# EAGLE board slot1 (EAGLE 6.6.0), part 1 of 2
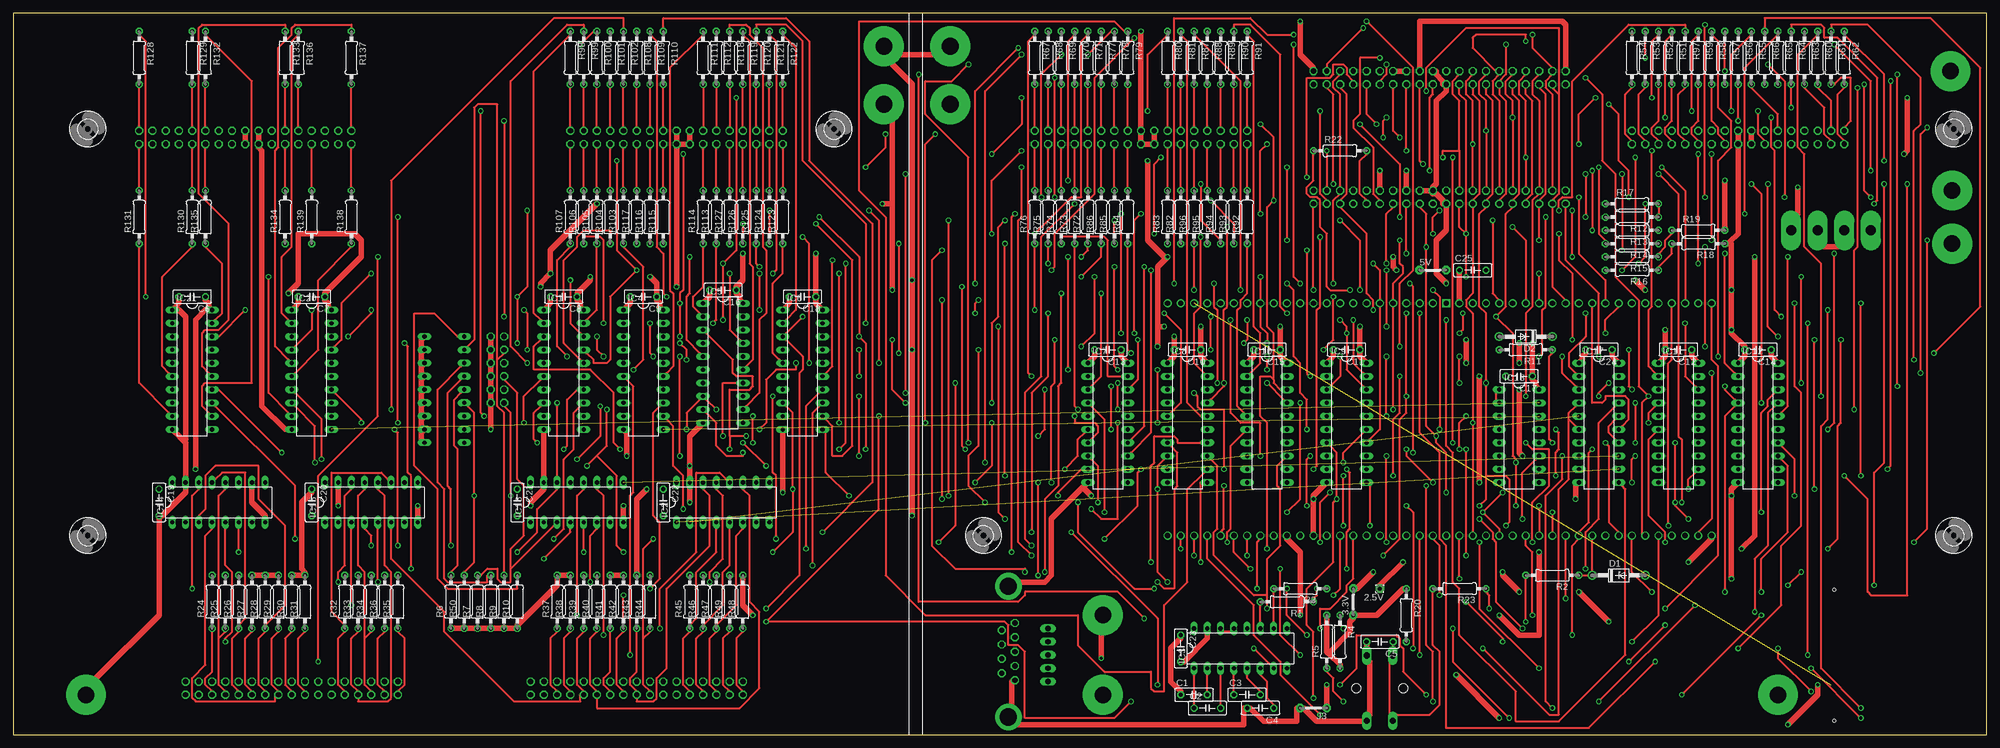
[diagram p3: board, top side]
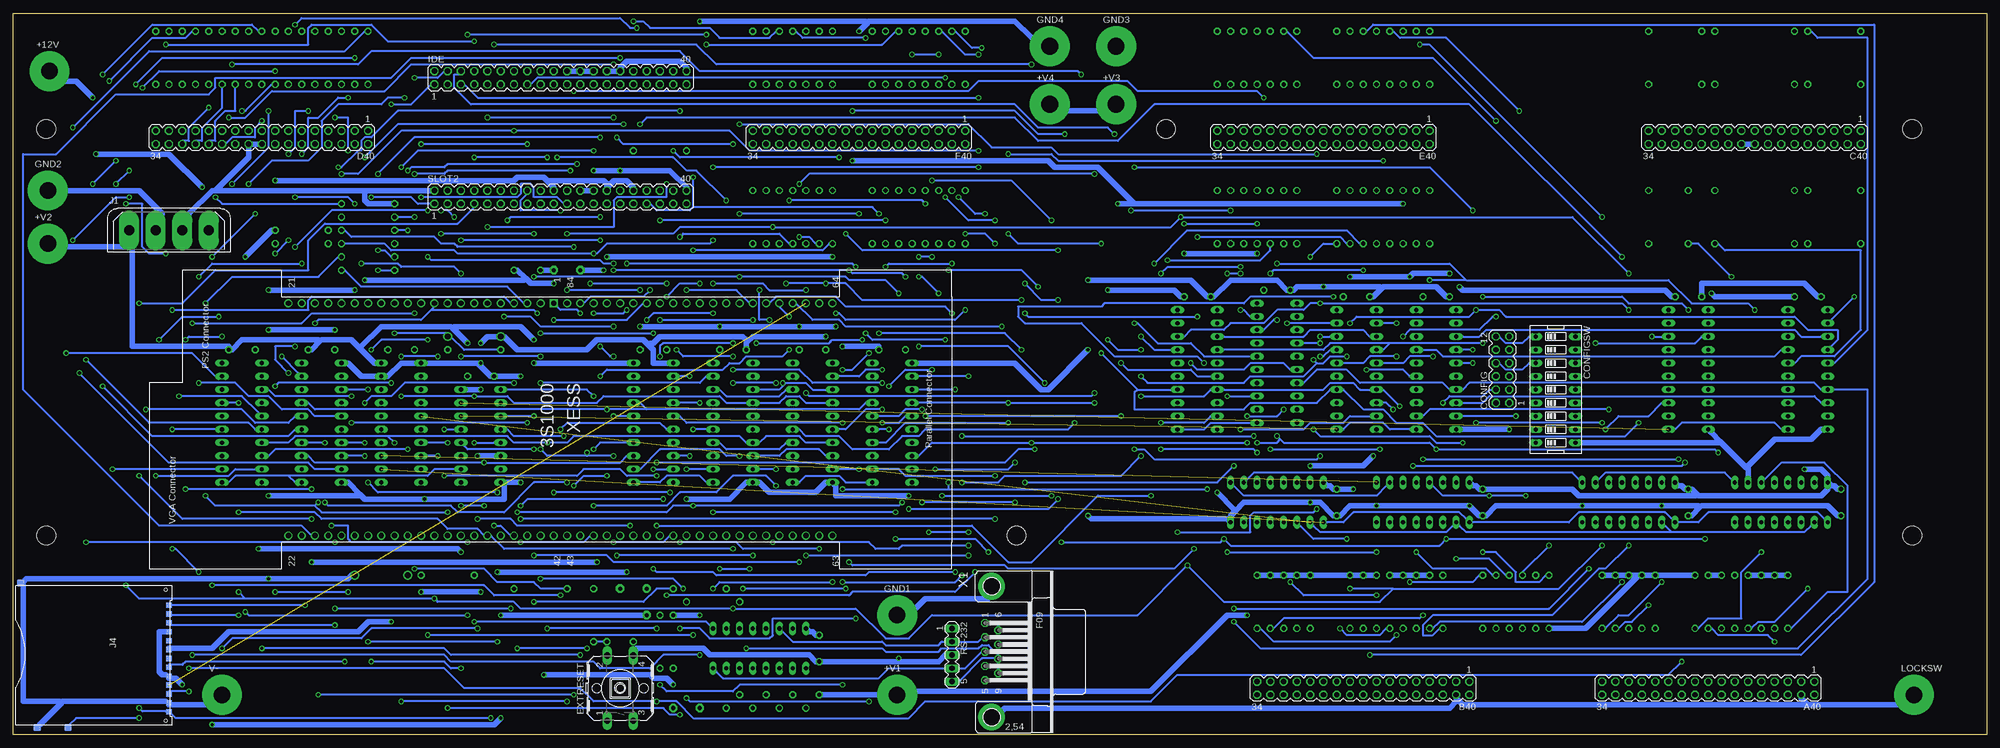
[diagram p4: board, bottom side, seen from below]

Size 377.82 x 138.11 mm. Coordinates in mm from the lower left corner, seen from the top.
Outline: 377.82,138.11 377.82,0 174.62,0 171.45,0 0,0 0,138.11 171.45,138.11 173.04,138.11
Outline: 377.82,138.11 173.99,138.11
Outline: 173.99,138.11 173.04,138.11
Outline: 377.82,138.11 173.99,138.11
Outline: 173.99,138.11 173.04,138.11
Copper layers (1*16): Top 0.035mm / dielectric 1.5mm / Bottom 0.035mm
Design rules "15mils": minimum track width 15mil, minimum drill 24mil, track to track 15mil, track to pad 10mil, pad to pad 10mil, via to via 10mil, smd to smd 10mil, copper to edge 25mil, drill to drill 10mil, minimum pad ring 10mil, minimum via ring 8mil, stop-mask expansion 0mil, vias tented up to drill 0mil, thermal gap 10mil
Net classes: 1 supply: width 1.016 mm

## Footprints (pad centres in the part's own frame; a part is rotated, then mirrored left to right if it is on the bottom)
1,6/0,8 = drill 0.813 pad 1.6 octagon: 1 0,0
05 = drill 0.813 pad 1.6 octagon: 1 -2.54,0; 2 2.54,0
SPADELUG = drill 3.175 pad 7.62: 1 0,0
MA17-2 = drill 1.016 octagon: 1 -20.32,-1.27; 2 -20.32,1.27; 3 -17.78,-1.27; 4 -17.78,1.27; 5 -15.24,-1.27; 6 -15.24,1.27; 7 -12.7,-1.27; 8 -12.7,1.27; 9 -10.16,-1.27; 10 -10.16,1.27; 11 -7.62,-1.27; 12 -7.62,1.27; 13 -5.08,-1.27; 14 -5.08,1.27; 15 -2.54,-1.27; 16 -2.54,1.27; 17 0,-1.27; 18 0,1.27; 19 2.54,-1.27; 20 2.54,1.27; 21 5.08,-1.27; 22 5.08,1.27; 23 7.62,-1.27; 24 7.62,1.27; 25 10.16,-1.27; 26 10.16,1.27; 27 12.7,-1.27; 28 12.7,1.27; 29 15.24,-1.27; 30 15.24,1.27; 31 17.78,-1.27; 32 17.78,1.27; 33 20.32,-1.27; 34 20.32,1.27
C050-025X075 = drill 0.813 octagon: 1 -2.54,0; 2 2.54,0
MA06-2 = drill 1.016 octagon: 1 -6.35,-1.27; 2 -6.35,1.27; 3 -3.81,-1.27; 4 -3.81,1.27; 5 -1.27,-1.27; 6 -1.27,1.27; 7 1.27,-1.27; 8 1.27,1.27; 9 3.81,-1.27; 10 3.81,1.27; 11 6.35,-1.27; 12 6.35,1.27
EDG-09 = drill 0.813 long: 1 -10.16,-3.81; 2 -7.62,-3.81; 3 -5.08,-3.81; 4 -2.54,-3.81; 5 0,-3.81; 6 2.54,-3.81; 7 5.08,-3.81; 8 7.62,-3.81; 9 10.16,-3.81; 10 10.16,3.81; 11 7.62,3.81; 12 5.08,3.81; 13 2.54,3.81; 14 0,3.81; 15 -2.54,3.81; 16 -5.08,3.81; 17 -7.62,3.81; 18 -10.16,3.81
DO41Z10 = drill 1.118: A 5.08,0; C -5.08,0
B3F-40XX = drill 1.194 long: 1 -6.248,2.489; 2 6.248,2.489; 3 -6.248,-2.489; 4 6.248,-2.489 | hole 1.803: 0,-4.496; 0,4.496
DIL20 = drill 0.813 long: 1 -11.43,-3.81; 2 -8.89,-3.81; 3 -6.35,-3.81; 4 -3.81,-3.81; 5 -1.27,-3.81; 6 1.27,-3.81; 7 3.81,-3.81; 8 6.35,-3.81; 9 8.89,-3.81; 10 11.43,-3.81; 11 11.43,3.81; 12 8.89,3.81; 13 6.35,3.81; 14 3.81,3.81; 15 1.27,3.81; 16 -1.27,3.81; 17 -3.81,3.81; 18 -6.35,3.81; 19 -8.89,3.81; 20 -11.43,3.81
DIL16 = drill 0.813 long: 1 -8.89,-3.81; 2 -6.35,-3.81; 3 -3.81,-3.81; 4 -1.27,-3.81; 5 1.27,-3.81; 6 3.81,-3.81; 7 6.35,-3.81; 8 8.89,-3.81; 9 8.89,3.81; 10 6.35,3.81; 11 3.81,3.81; 12 1.27,3.81; 13 -1.27,3.81; 14 -3.81,3.81; 15 -6.35,3.81; 16 -8.89,3.81
MA20-2 = drill 1.016 octagon: 1 -24.13,-1.27; 2 -24.13,1.27; 3 -21.59,-1.27; 4 -21.59,1.27; 5 -19.05,-1.27; 6 -19.05,1.27; 7 -16.51,-1.27; 8 -16.51,1.27; 9 -13.97,-1.27; 10 -13.97,1.27; 11 -11.43,-1.27; 12 -11.43,1.27; 13 -8.89,-1.27; 14 -8.89,1.27; 15 -6.35,-1.27; 16 -6.35,1.27; 17 -3.81,-1.27; 18 -3.81,1.27; 19 -1.27,-1.27; 20 -1.27,1.27; 21 1.27,-1.27; 22 1.27,1.27; 23 3.81,-1.27; 24 3.81,1.27; 25 6.35,-1.27; 26 6.35,1.27; 27 8.89,-1.27; 28 8.89,1.27; 29 11.43,-1.27; 30 11.43,1.27; 31 13.97,-1.27; 32 13.97,1.27; 33 16.51,-1.27; 34 16.51,1.27; 35 19.05,-1.27; 36 19.05,1.27; 37 21.59,-1.27; 38 21.59,1.27; 39 24.13,-1.27; 40 24.13,1.27
FLOPPY-4 = drill 1.93 pad 3.81 long: 1 7.62,0; 2 2.54,0; 3 -2.54,0; 4 -7.62,0
SCDA5A = smd 1 x 1.3: 1 -7.525,-0.65; 2 -5.825,-0.65; 3 -4.125,-0.65; 3A -2.425,-0.65; 4 -0.725,-0.65; 4A 0.975,-0.65; 5 2.675,-0.65; 6 4.375,-0.65; 7 6.075,-0.65; 8 7.775,-0.65; 9 -9.225,-0.65; 10 11.175,-0.65; 11 9.475,-0.65 | smd 1.4 x 1.4: 12 14.2,-19.955; 13 14.2,-25.875; 14 -13.475,-28.975 | hole 0.61: 12.875,-1.235; -12.125,-1.235
0207/10 = drill 0.813 octagon: 1 -5.08,0; 2 5.08,0
MA05-1 = drill 1.016 long: 1 -5.08,0; 2 -2.54,0; 3 0,0; 4 2.54,0; 5 5.08,0
3,6 = hole 3.6: 0,0
F09HP = drill 1.016 octagon: 1 -5.486,-1.27; 2 -2.743,-1.27; 3 0,-1.27; 4 2.743,-1.27; 5 5.486,-1.27; 6 -4.115,1.27; 7 -1.372,1.27; 8 1.372,1.27; 9 4.115,1.27 | drill 3.302 pad 5.08: G1 -12.522,0; G2 12.522,0
3S1000 = drill 1.016 square: 1 0,0 | drill 1.016: 2 0,-2.54; 3 0,-5.08; 4 0,-7.62; 5 0,-10.16; 6 0,-12.7; 7 0,-15.24; 8 0,-17.78; 9 0,-20.32; 10 0,-22.86; 11 0,-25.4; 12 0,-27.94; 13 0,-30.48; 14 0,-33.02; 15 0,-35.56; 16 0,-38.1; 17 0,-40.64; 18 0,-43.18; 19 0,-45.72; 20 0,-48.26; 21 0,-50.8; 22 44.45,-50.8; 23 44.45,-48.26; 24 44.45,-45.72; 25 44.45,-43.18; 26 44.45,-40.64; 27 44.45,-38.1; 28 44.45,-35.56; 29 44.45,-33.02; 30 44.45,-30.48; 31 44.45,-27.94; 32 44.45,-25.4; 33 44.45,-22.86; 34 44.45,-20.32; 35 44.45,-17.78; 36 44.45,-15.24; 37 44.45,-12.7; 38 44.45,-10.16; 39 44.45,-7.62; 40 44.45,-5.08; 41 44.45,-2.54; 42 44.45,0; 43 44.45,2.54; 44 44.45,5.08; 45 44.45,7.62; 46 44.45,10.16; 47 44.45,12.7; 48 44.45,15.24; 49 44.45,17.78; 50 44.45,20.32; 51 44.45,22.86; 52 44.45,25.4; 53 44.45,27.94; 54 44.45,30.48; 55 44.45,33.02; 56 44.45,35.56; 57 44.45,38.1; 58 44.45,40.64; 59 44.45,43.18; 60 44.45,45.72; 61 44.45,48.26; 62 44.45,50.8; 63 44.45,53.34; 64 0,53.34; 65 0,50.8; 66 0,48.26; 67 0,45.72; 68 0,43.18; 69 0,40.64; 70 0,38.1; 71 0,35.56; 72 0,33.02; 73 0,30.48; 74 0,27.94; 75 0,25.4; 76 0,22.86; 77 0,20.32; 78 0,17.78; 79 0,15.24; 80 0,12.7; 81 0,10.16; 82 0,7.62; 83 0,5.08; 84 0,2.54

## Placement (x,y rotation side)
2.5V  [1,6/0,8]  261.62,27.94 180 top
3.3V  J5MM  [05]  256.54,25.4 90 top
5V  J5MM  [05]  271.78,88.9 0 top
+12V  LUG  [SPADELUG]  370.84,127 0 bottom
+V1  LUG  [SPADELUG]  208.6,7.62 0 bottom
+V2  LUG  [SPADELUG]  371.16,93.98 0 bottom
+V3  LUG  [SPADELUG]  166.69,120.65 0 bottom
+V4  LUG  [SPADELUG]  179.39,120.65 0 bottom
A40  [MA17-2]  53.34,8.89 180 bottom
B40  [MA17-2]  119.38,8.89 180 bottom
C1  0.1uf  [C050-025X075]  226.06,7.62 0 top
C2  0.1uf  [C050-025X075]  228.6,5.08 0 top
C3  0.1uf  [C050-025X075]  236.22,7.62 0 top
C4  0.1uf  [C050-025X075]  238.76,5.08 180 top
C5  0.1uf  [C050-025X075]  261.62,17.78 180 top
C6  0.1uf  [C050-025X075]  34.29,83.82 180 top
C7  0.1uf  [C050-025X075]  57.15,83.82 180 top
C8  0.1uf  [C050-025X075]  105.41,83.82 180 top
C9  0.1uf  [C050-025X075]  120.65,83.82 180 top
C10  0.1uf  [C050-025X075]  224.79,73.66 180 top
C11  0.1uf  [C050-025X075]  255.27,73.66 180 top
C12  0.1uf  [C050-025X075]  318.77,73.66 180 top
C13  0.1uf  [C050-025X075]  209.55,73.66 180 top
C14  0.1uf  [C050-025X075]  334.01,73.66 180 top
C15  0.1uf  [C050-025X075]  240.03,73.66 180 top
C16  0.1uf  [C050-025X075]  135.89,85.09 180 top
C17  0.1uf  [C050-025X075]  288.29,68.58 180 top
C18  0.1uf  [C050-025X075]  151.13,83.82 180 top
C19  0.1uf  [C050-025X075]  27.94,44.45 270 top
C20  0.1uf  [C050-025X075]  57.15,44.45 270 top
C21  0.1uf  [C050-025X075]  96.52,44.45 270 top
C22  0.1uf  [C050-025X075]  124.46,44.45 270 top
C23  0.1uf  [C050-025X075]  223.52,16.51 270 top
C24  0.1uf  [C050-025X075]  303.53,73.66 180 top
C25  0.1uf  [C050-025X075]  279.4,88.9 0 top
C40  [MA17-2]  44.45,114.3 180 bottom
CONFIG  [MA06-2]  92.71,69.85 90 bottom
CONFIGSW  [EDG-09]  82.55,66.04 270 bottom
D1  1N4728  [DO41Z10]  307.34,30.48 0 top
D2  1N4728  [DO41Z10]  289.56,76.2 180 top
D40  [MA17-2]  330.2,114.3 180 bottom
E40  [MA17-2]  127,114.3 180 bottom
EXTRESET  [B3F-40XX]  261.62,8.89 90 bottom
F40  [MA17-2]  215.9,114.3 180 bottom
GND1  LUG  [SPADELUG]  208.6,22.86 0 bottom
GND2  LUG  [SPADELUG]  371.16,104.14 0 bottom
GND3  LUG  [SPADELUG]  166.69,131.76 0 bottom
GND4  LUG  [SPADELUG]  179.39,131.76 0 bottom
IC1  74LS374N  [DIL20]  105.41,69.85 270 top
IC2  74HC165N  [DIL16]  135.89,44.45 0 top
IC3  MAX232A  [DIL16]  234.95,16.51 0 top
IC4  74LS374N  [DIL20]  120.65,69.85 270 top
IC5  74LS374N  [DIL20]  135.89,71.12 270 top
IC6  74LS374N  [DIL20]  151.13,69.85 270 top
IC7  74LS374N  [DIL20]  209.55,59.69 270 top
IC8  74LS374N  [DIL20]  224.79,59.69 270 top
IC9  74LS374N  [DIL20]  255.27,59.69 270 top
IC10  74LS374N  [DIL20]  240.03,59.69 270 top
IC11  74LS374N  [DIL20]  318.77,59.69 270 top
IC12  74LS374N  [DIL20]  334.01,59.69 270 top
IC13  74LS138N  [DIL16]  288.29,57.15 270 top
IC14  74HC165N  [DIL16]  39.37,44.45 0 top
IC15  74HC165N  [DIL16]  68.58,44.45 0 top
IC17  74LS244N  [DIL20]  303.53,59.69 270 top
IC18  74HC165N  [DIL16]  107.95,44.45 0 top
IC20  74LS374N  [DIL20]  57.15,69.85 270 top
IC21  74LS374N  [DIL20]  34.29,69.85 270 top
IDE  [MA20-2]  273.05,125.73 0 bottom
J1  [FLOPPY-4]  347.98,96.52 0 bottom
J3  J5MM  [05]  248.92,5.08 180 top
J4  SDCARD  [SCDA5A]  347.35,15.56 270 bottom
LOCKSW  LUG  [SPADELUG]  13.97,7.62 0 bottom
R1  330  [0207/10]  243.84,25.4 180 top
R2  330  [0207/10]  294.64,30.48 180 top
R3  330  [0207/10]  246.38,27.94 180 top
R4  330  [0207/10]  254,17.78 270 top
R5  330  [0207/10]  251.46,17.78 90 top
R6  3K  [0207/10]  83.82,25.4 90 top
R7  3K  [0207/10]  88.9,25.4 90 top
R8  3K  [0207/10]  91.44,25.4 90 top
R9  3K  [0207/10]  93.98,25.4 90 top
R10  3K  [0207/10]  96.52,25.4 90 top
R11  330  [0207/10]  289.56,73.66 180 top
R12  330  [0207/10]  309.88,99.06 180 top
R13  47  [0207/10]  309.88,96.52 180 top
R14  47  [0207/10]  309.88,93.98 180 top
R15  330  [0207/10]  309.88,91.44 180 top
R16  330  [0207/10]  309.88,88.9 180 top
R17  10K  [0207/10]  309.88,101.6 0 top
R18  10K  [0207/10]  322.58,93.98 180 top
R19  10K  [0207/10]  322.58,96.52 0 top
R20  4.7K  [0207/10]  266.7,22.86 270 top
R22  330  [0207/10]  254,111.76 0 top
R23  330  [0207/10]  276.86,27.94 180 top
R24  3K  [0207/10]  38.1,25.4 90 top
R25  3K  [0207/10]  40.64,25.4 90 top
R26  3K  [0207/10]  43.18,25.4 90 top
R27  3K  [0207/10]  45.72,25.4 90 top
R28  3K  [0207/10]  48.26,25.4 90 top
R29  3K  [0207/10]  50.8,25.4 90 top
R30  3K  [0207/10]  53.34,25.4 90 top
R31  3K  [0207/10]  55.88,25.4 90 top
R32  3K  [0207/10]  63.5,25.4 90 top
R33  3K  [0207/10]  66.04,25.4 90 top
R34  3K  [0207/10]  68.58,25.4 90 top
R35  3K  [0207/10]  73.66,25.4 90 top
R36  3K  [0207/10]  71.12,25.4 90 top
R37  3K  [0207/10]  104.14,25.4 90 top
R38  3K  [0207/10]  106.68,25.4 90 top
R39  3K  [0207/10]  109.22,25.4 90 top
R40  3K  [0207/10]  111.76,25.4 90 top
R41  3K  [0207/10]  114.3,25.4 90 top
R42  3K  [0207/10]  116.84,25.4 90 top
R43  3K  [0207/10]  119.38,25.4 90 top
R44  3K  [0207/10]  121.92,25.4 90 top
R45  3K  [0207/10]  129.54,25.4 90 top
R46  3K  [0207/10]  132.08,25.4 90 top
R47  3K  [0207/10]  134.62,25.4 90 top
R48  3K  [0207/10]  139.7,25.4 90 top
R49  3K  [0207/10]  137.16,25.4 90 top
R50  3K  [0207/10]  86.36,25.4 90 top
R51  [0207/10]  317.5,129.54 270 top
R52  [0207/10]  314.96,129.54 270 top
R53  [0207/10]  312.42,129.54 270 top
R54  [0207/10]  309.88,129.54 270 top
R55  [0207/10]  332.74,129.54 270 top
R56  [0207/10]  330.2,129.54 270 top
R57  [0207/10]  327.66,129.54 270 top
R58  3K  [0207/10]  325.12,129.54 270 top
R59  [0207/10]  322.58,129.54 270 top
R60  [0207/10]  345.44,129.54 270 top
R61  [0207/10]  347.98,129.54 270 top
R62  [0207/10]  350.52,129.54 270 top
R63  [0207/10]  342.9,129.54 270 top
R64  [0207/10]  340.36,129.54 270 top
R65  [0207/10]  337.82,129.54 270 top
R66  3K  [0207/10]  335.28,129.54 270 top
R67  [0207/10]  195.58,129.54 270 top
R68  [0207/10]  198.12,129.54 270 top
R69  [0207/10]  200.66,129.54 270 top
R70  [0207/10]  203.2,129.54 270 top
R71  [0207/10]  205.74,129.54 270 top
R72  [0207/10]  205.74,99.06 90 top
R73  [0207/10]  203.2,99.06 90 top
R74  3K  [0207/10]  200.66,99.06 90 top
R75  [0207/10]  198.12,99.06 90 top
R76  [0207/10]  195.58,99.06 90 top
R77  [0207/10]  208.28,129.54 270 top
R78  [0207/10]  210.82,129.54 270 top
R79  [0207/10]  213.36,129.54 270 top
R80  [0207/10]  220.98,129.54 270 top
R81  [0207/10]  223.52,129.54 270 top
R82  3K  [0207/10]  223.52,99.06 90 top
R83  [0207/10]  220.98,99.06 90 top
R84  [0207/10]  213.36,99.06 90 top
R85  [0207/10]  210.82,99.06 90 top
R86  [0207/10]  208.28,99.06 90 top
R87  [0207/10]  226.06,129.54 270 top
R88  [0207/10]  228.6,129.54 270 top
R89  [0207/10]  231.14,129.54 270 top
R90  3K  [0207/10]  233.68,129.54 270 top
R91  [0207/10]  236.22,129.54 270 top
R92  [0207/10]  236.22,99.06 90 top
R93  [0207/10]  233.68,99.06 90 top
R94  [0207/10]  231.14,99.06 90 top
R95  [0207/10]  228.6,99.06 90 top
R96  [0207/10]  226.06,99.06 90 top
R97  3K  [0207/10]  320.04,129.54 270 top
R98  [0207/10]  106.68,129.54 270 top
R99  [0207/10]  109.22,129.54 270 top
R100  [0207/10]  111.76,129.54 270 top
R101  [0207/10]  114.3,129.54 270 top
R102  [0207/10]  116.84,129.54 270 top
R103  [0207/10]  116.84,99.06 90 top
R104  [0207/10]  114.3,99.06 90 top
R105  3K  [0207/10]  111.76,99.06 90 top
R106  [0207/10]  109.22,99.06 90 top
R107  [0207/10]  106.68,99.06 90 top
R108  [0207/10]  119.38,129.54 270 top
R109  [0207/10]  121.92,129.54 270 top
R110  [0207/10]  124.46,129.54 270 top
R111  [0207/10]  132.08,129.54 270 top
R112  [0207/10]  134.62,129.54 270 top
R113  3K  [0207/10]  134.62,99.06 90 top
R114  [0207/10]  132.08,99.06 90 top
R115  [0207/10]  124.46,99.06 90 top
R116  [0207/10]  121.92,99.06 90 top
R117  [0207/10]  119.38,99.06 90 top
R118  [0207/10]  137.16,129.54 270 top
R119  [0207/10]  139.7,129.54 270 top
R120  [0207/10]  142.24,129.54 270 top
R121  3K  [0207/10]  144.78,129.54 270 top
R122  [0207/10]  147.32,129.54 270 top
R123  [0207/10]  147.32,99.06 90 top
R124  [0207/10]  144.78,99.06 90 top
R125  [0207/10]  142.24,99.06 90 top
R126  [0207/10]  139.7,99.06 90 top
R127  3K  [0207/10]  137.16,99.06 90 top
R128  [0207/10]  24.13,129.54 270 top
R129  [0207/10]  34.29,129.54 270 top
R130  [0207/10]  34.29,99.06 90 top
R131  [0207/10]  24.13,99.06 90 top
R132  [0207/10]  36.83,129.54 270 top
R133  [0207/10]  52.07,129.54 270 top
R134  [0207/10]  52.07,99.06 90 top
R135  3K  [0207/10]  36.83,99.06 90 top
R136  [0207/10]  54.61,129.54 270 top
R137  [0207/10]  64.77,129.54 270 top
R138  [0207/10]  64.77,99.06 90 top
R139  3K  [0207/10]  57.15,99.06 90 top
RS-232  [MA05-1]  198.12,15.24 270 bottom
SLOT2  [MA20-2]  273.05,102.87 0 bottom
U$5  [3,6]  371.48,115.89 0 top
U$6  [3,6]  371.48,38.1 0 top
U$7  [3,6]  185.74,38.1 0 top
U$8  [3,6]  14.29,38.1 0 top
U$9  [3,6]  14.29,115.89 0 top
U$11  [3,6]  157.16,115.89 0 top
V-  LUG  [SPADELUG]  337.82,7.62 0 bottom
X1  [F09HP]  190.5,15.88 270 bottom
XESS  3S1000  [3S1000]  274.32,82.55 270 bottom

## Tracks (layer width: path | path; a pad name or v marks a point on that pad's centre or on a via)
3S-LCLK  (via drill 0.61)
  Top 0.381: 297.81,60.33 299.08,59.05 IC17.6 | 297.81,60.33 297.81,61.59 299.08,62.87 IC17.4 | v231.78,47.62 231.78,39.37 231.14,38.73 XESS.59 | v266.7,43.81 267.97,42.55 v267.97,16.51 | v281.31,16.51 294,3.81 295.91,3.81 295.91,46.99 297.81,48.9 297.81,60.33
  Bottom 0.381: v231.78,47.62 233.68,49.53 240.03,49.53 243.21,46.35 250.19,46.35 252.73,43.81 v266.7,43.81 | v267.97,16.51 v281.31,16.51
3S-LSER  (via drill 0.61)
  Top 0.381: v300.99,80.64 300.99,76.2 297.81,73.03 297.81,70.48 299.08,69.22 IC17.2 | v343.54,15.24 v343.54,78.74 | v246.38,15.24 242.57,19.05 v242.57,31.75 | v236.85,31.75 233.68,34.92 233.68,37.47 XESS.58
  Bottom 0.381: v300.99,80.64 320.68,80.64 322.58,78.74 v343.54,78.74 | v343.54,15.24 295.27,15.24 294,13.97 266.7,13.97 265.43,12.7 255.91,12.7 253.37,15.24 v246.38,15.24 | v242.57,31.75 v236.85,31.75
3S-SCLK
  Top 0.381: IC17.15 307.98,59.05 309.25,60.33 309.25,64.14 308.61,64.77 304.8,64.77 304.8,64.14 304.17,63.5 302.26,63.5 302.26,81.92 XESS.12
3S-SSER  (via drill 0.61)
  Top 0.381: v304.8,76.83 304.8,79.38 307.34,81.92 XESS.14
  Bottom 0.381: R11.2 285.12,73.66 291.46,73.66 294,76.2 D2.C 294.64,76.83 v304.8,76.83
!3S-LCL  (via drill 0.61)
  Top 0.381: v274.32,79.38 274.32,55.24 275.59,53.98 275.59,29.21 276.86,27.94 276.86,19.05 287.65,8.26 287.65,2.54 295.91,2.54 308.61,15.24 308.61,46.99 307.98,47.62 IC17.11
  Bottom 0.381: v274.32,79.38 260.35,79.38 257.18,82.55 XESS.78
!3S-SCL  (via drill 0.61)
  Top 0.381: v296.55,53.34 296.55,48.9 293.37,45.72 293.37,6.35 v294.64,5.08 | v250.19,3.81 242.57,11.43 242.57,13.97 237.49,19.05 237.49,24.77 228.6,33.66 228.6,37.47 XESS.60
  Bottom 0.381: v296.55,53.34 298.45,53.34 IC17.8 | v294.64,5.08 253.37,5.08 252.09,3.81 v250.19,3.81
!SCL  (1 unrouted)
  Bottom 0.381: IC2.1 126.36,40.64 123.19,40.64 121.28,42.55 100.97,42.55 99.69,41.27 IC18.1 98.42,40.64 80.01,40.64 78.11,42.55 61.59,42.55 60.33,41.27 IC15.1 59.05,40.64 55.24,40.64 53.34,42.55 32.38,42.55 31.11,41.27 IC14.1
!SSER  (1 unrouted)
+2V5  (via drill 0.61)
  Top 1.016: v320.68,33.02 325.12,37.47 XESS.22 | v266.06,33.02 261.62,28.57 2.5V.1
  Bottom 1.016: v266.06,33.02 v320.68,33.02
+3V3  (via drill 0.61)
  Top 1.016: R20.1 266.06,27.94 260.99,22.86 257.18,22.86 3.3V.1 256.54,22.23 255.91,21.59 255.91,19.68 252.09,15.88 251.78,15.56 | 251.78,15.56 251.46,15.88 251.46,22.23 R5.2 | 251.78,15.56 254,13.34 R4.2 | v246.38,22.86 246.38,34.92 243.84,37.47 XESS.54 | v327.66,106.05 327.66,97.16 R19.2 | v284.48,22.86 288.29,19.05 292.1,19.05 v292.1,34.92 | v330.83,35.56 333.38,38.1 v333.38,91.44
  Bottom 1.016: v246.38,22.86 250.82,22.86 R5.2 | 263.84,105.09 264.16,104.78 SLOT2.28 | 263.84,105.09 262.89,106.05 260.35,106.05 259.08,104.78 SLOT2.32 | v327.66,106.05 281.94,106.05 281.31,106.68 276.23,106.68 275.27,105.73 | 275.27,105.73 274.32,104.78 SLOT2.20 | 263.84,105.09 264.16,105.41 264.8,106.05 274.95,106.05 275.27,105.73 | v284.48,22.86 257.18,22.86 3.3V.1 | v292.1,34.92 292.74,35.56 v330.83,35.56 | v333.38,91.44 328.3,96.52 R19.2
+5V
  Top 1.016: XESS.2 276.86,83.19 276.86,88.27 C25.1
  Bottom 1.016: C25.1 276.23,88.9 274.95,88.9 5V.2
+12V  (via drill 0.61)
  Top 1.016: v341.63,104.78 341.63,99.69 J1.1 | v361.95,111.12 362.58,111.76 v362.58,121.92
  Bottom 1.016: v341.63,104.78 347.98,111.12 v361.95,111.12 | v362.58,121.92 365.76,125.09 367.67,125.09 +12V.1
AC0
  Top 0.381: R101.2 114.3,123.83 114.3,116.2 E40.7
AC1
  Top 0.381: R106.2 109.22,104.78 109.22,112.39 E40.4
AC2
  Top 0.381: R111.2 132.08,123.83 132.08,116.2 E40.21
AC3
  Top 0.381: R116.2 121.92,104.78 121.92,112.39 E40.14
AC4
  Top 0.381: R121.2 144.78,123.83 144.78,116.2 E40.31
AC5
  Top 0.381: R126.2 139.7,104.78 139.7,112.39 E40.28
AC6
  Top 0.381: R70.2 203.2,123.83 203.2,116.2 F40.7
AC7
  Top 0.381: R75.2 198.12,104.78 198.12,112.39 F40.4
AC8
  Top 0.381: R80.2 220.98,123.83 220.98,116.2 F40.21
AC9
  Top 0.381: R85.2 210.82,104.78 210.82,112.39 F40.14
AC10
  Top 0.381: R90.2 233.68,123.83 233.68,116.2 F40.31
AC11
  Top 0.381: R95.2 228.6,104.78 228.6,112.39 F40.28
AND
  Top 0.381: R54.2 309.88,123.83 308.61,122.56 308.61,114.94 309.88,113.67 D40.2
BREAK  (via drill 0.61)
  Top 0.381: v334.01,119.38 334.01,114.94 335.28,113.67 D40.22
  Bottom 0.381: v334.01,119.38 333.38,119.38 328.3,124.46 R57.2
CA
  Top 0.381: R63.2 342.9,123.83 346.71,120.02 346.71,114.94 347.98,113.67 D40.32
CF1  (via drill 0.61)
  Top 0.381: R50.2 86.36,31.11 88.27,33.02 v88.27,45.72 88.27,61.59 87,62.87 CONFIGSW.6 | v95.25,45.72 95.25,61.59 93.98,62.87 CONFIG.2
  Bottom 0.381: v88.27,45.72 v95.25,45.72 104.14,45.72 106.05,47.62 IC18.13
CF2  (via drill 0.61)
  Top 0.381: v104.14,63.5 104.14,49.53 IC18.14 104.14,46.99 100.33,43.18 100.33,38.73 v96.52,34.92 | R6.2 83.82,31.11 85.09,32.38 85.09,54.61 84.45,55.24 84.45,64.14 85.72,65.41 CONFIGSW.5
  Bottom 0.381: v104.14,63.5 102.87,64.77 96.52,64.77 95.25,66.04 94.61,66.04 CONFIG.4 | v96.52,34.92 93.98,34.92 90.17,31.11 90.17,29.21 85.72,29.21 84.45,30.48 R6.2
CF3  (via drill 0.61)
  Top 0.381: 95.25,31.75 95.25,29.21 93.34,29.21 92.71,29.84 92.71,31.75 90.81,31.75 89.53,30.48 R7.2 | 95.25,31.75 103.5,40.01 IC18.3 | v83.82,36.2 83.82,46.99 83.19,47.62 83.19,65.41 85.72,67.94 CONFIGSW.4 | 95.25,31.75 95.25,35.56 97.79,38.1 97.79,47.62 96.52,48.9 96.52,65.41 93.98,67.94 CONFIG.6
  Bottom 0.381: v83.82,36.2 88.9,31.11 R7.2
CF4  (via drill 0.61)
  Top 0.381: v101.6,33.66 106.68,38.73 106.68,39.37 IC18.4 | CONFIGSW.3 85.72,70.48 81.28,66.04 81.28,48.26 82.55,46.99 82.55,29.84 83.19,29.21 90.81,29.21 90.81,30.48 R8.2
  Bottom 0.381: CONFIGSW.3 87.63,71.12 88.9,69.85 92.08,69.85 93.34,71.12 CONFIG.8 | v101.6,33.66 95.25,33.66 92.08,30.48 R8.2
CF5  (via drill 0.61)
  Top 0.381: 92.71,71.75 92.71,62.87 93.98,61.59 93.98,31.11 R9.2 | 92.71,71.75 93.98,73.03 CONFIG.10 | 92.71,71.75 92.71,120.65 88.9,120.65 88.27,120.02 88.27,75.56 87,74.3 CONFIGSW.2 | v109.22,34.92 109.22,39.37 IC18.5
  Bottom 0.381: v109.22,34.92 106.05,31.75 95.89,31.75 94.61,30.48 R9.2
CF6  (via drill 0.61)
  Top 0.381: v110.49,29.21 110.49,38.1 111.76,39.37 IC18.6 | CONFIGSW.1 85.09,76.2 80.64,80.64 76.83,80.64 76.83,51.44 81.28,46.99 81.28,29.84 83.19,27.94 96.52,27.94 96.52,29.84 R10.2
  Bottom 0.381: CONFIGSW.1 87.63,76.2 88.9,74.93 92.08,74.93 93.34,76.2 CONFIG.12 | v110.49,29.21 98.42,29.21 97.16,30.48 R10.2
CLK  (via drill 0.61)
  Top 0.381: v299.72,102.87 299.72,92.08 304.8,87 304.8,83.19 XESS.13
  Bottom 0.381: v299.72,102.87 281.31,102.87 280.67,103.5 280.67,105.41 278.76,105.41 278.13,104.78 278.13,102.87 273.69,102.87 272.42,101.6 SLOT2.21
CONT
  Top 0.381: B40.28 132.08,8.26 130.81,9.53 130.81,18.41 132.08,19.68 R46.1 132.08,20.95 135.89,24.77 135.89,31.11 137.16,32.38 137.16,39.37 IC2.5
DCA
  Top 0.381: R51.2 317.5,123.83 317.5,117.47 316.23,116.2 316.23,114.94 317.5,113.67 D40.8
DEFER
  Bottom 0.381: R66.2 335.28,123.83 335.28,119.38 337.19,119.38 339.09,117.47 339.09,113.67 340.36,113.67 D40.26
DEP  (via drill 0.61)
  Top 0.381: 120.65,18.41 121.92,19.68 R44.1 | 120.65,18.41 120.65,9.53 121.92,8.26 B40.20 | v122.56,37.47 120.65,35.56 120.65,18.41
  Bottom 0.381: v122.56,37.47 128.91,37.47 131.44,40.01 IC2.3
DF0
  Top 0.381: R128.2 24.13,123.83 24.13,116.2 C40.1
DF1
  Top 0.381: R130.2 34.29,104.78 34.29,112.39 C40.10
DF2
  Top 0.381: R132.2 36.83,123.83 36.83,116.2 C40.11
EXAM
  Top 0.381: B40.26 129.54,8.26 128.27,9.53 128.27,18.41 129.54,19.68 R45.1 129.54,20.95 130.81,22.23 130.81,31.11 134.62,34.92 134.62,39.37 IC2.4
EXECUTE
  Bottom 0.381: R65.2 337.82,123.83 337.82,120.02 341.63,116.2 341.63,113.67 342.9,113.67 D40.28
FETCH  (via drill 0.61)
  Top 0.381: v330.2,117.47 330.2,123.83 R56.2
  Bottom 0.381: v330.2,117.47 331.47,116.2 331.47,114.3 335.92,114.3 337.19,113.03 D40.24
GND  (via drill 0.61)
  Top 1.016: v299.08,45.09 299.08,47.62 IC17.10 | IC12.10 329.56,47.62 328.93,46.99 v328.93,45.72 v328.93,29.84 | IC11.1 315.6,71.75 316.23,72.39 316.23,73.03 C12.2 316.23,74.3 v316.23,77.47 | C24.2 300.99,73.03 300.36,72.39 300.36,71.75 IC17.1 | IC8.1 221.62,71.75 222.25,72.39 222.25,73.03 C10.2 222.25,74.3 v222.25,76.2 | IC10.1 236.85,71.75 237.49,72.39 237.49,73.03 C15.2 | IC9.1 252.09,71.75 252.73,72.39 252.73,73.03 C11.2 | v288.29,71.12 v288.29,74.93 | IC12.1 330.83,71.75 331.47,72.39 331.47,73.03 C14.2 331.47,74.3 328.93,76.83 v328.93,77.47 v328.93,85.09 328.93,93.98 328.61,94.3 | 328.61,94.3 330.2,95.89 330.2,112.39 D40.18 330.2,113.67 330.2,114.94 D40.17 | 328.61,94.3 328.3,93.98 R18.1 | D40.19 332.74,114.94 332.74,113.67 D40.20 | J1.2 346.71,93.34 349.25,93.34 J1.3 | v280.67,68.58 v280.67,48.26 | v261.62,107.95 261.62,104.78 SLOT2.30 | SLOT2.22 271.14,104.14 269.88,104.14 SLOT2.24 | v274.32,86.36 272.42,88.27 272.42,94.61 274.32,96.52 274.32,100.97 SLOT2.19 273.69,101.6 273.69,102.23 272.42,103.5 271.78,103.5 SLOT2.22 | v266.7,107.95 266.7,104.78 SLOT2.26 | IDE.26 266.06,127 264.8,127 IDE.28 | IDE.22 272.42,127 272.42,126.36 273.69,125.09 273.69,124.46 IDE.19 274.32,123.83 274.32,123.19 272.42,121.28 272.42,105.41 271.78,104.78 SLOT2.22 | IDE.2 297.18,127.64 297.18,135.89 296.55,136.53 269.24,136.53 269.24,127.64 IDE.24 | E40.18 127.64,113.03 128.91,113.03 E40.20 129.54,113.67 129.54,114.94 E40.19 | E40.17 127,114.94 127,113.67 E40.18 | IC6.1 147.96,81.92 148.59,82.55 148.59,83.19 C18.2 | IC5.1 132.72,83.19 133.35,83.82 133.35,84.45 C16.2 | IC1.1 102.23,81.92 102.87,82.55 102.87,83.19 C8.2
  Top 1.016: IC4.1 117.47,81.92 118.11,82.55 118.11,83.19 C9.2 | v127,85.72 127,112.39 E40.18 | F40.19 218.44,114.94 218.44,113.67 F40.20 217.81,113.03 216.53,113.03 F40.18 215.9,113.67 215.9,114.94 F40.17 215.9,116.2 v215.9,134.62 | IC7.1 206.38,71.75 207.01,72.39 207.01,73.03 C13.2 | GND4.1 175.9,130.18 170.18,130.18 GND3.1 168.28,128.27 172.09,124.46 v172.09,87 v172.09,73.66 v172.09,41.91 | v246.38,136.53 246.38,130.18 248.92,127.64 IDE.40 | C23.2 224.16,13.97 228.6,18.41 228.6,19.05 IC3.15 | X1.5 191.13,10.16 191.13,5.71 X1.G2 192.41,1.91 235.59,1.91 235.59,5.08 C4.2 236.85,5.08 239.4,2.54 245.75,2.54 245.75,5.08 J3.2 247.01,5.08 249.56,2.54 258.44,2.54 EXTRESET.3 259.71,3.81 259.71,13.97 EXTRESET.4 259.08,16.51 259.08,17.14 C5.2 | IC9.10 250.82,47.62 248.92,45.72 v248.92,45.09 248.92,38.73 XESS.52 | 204.79,47.31 198.75,41.27 198.75,30.48 197.49,29.21 192.41,29.21 X1.G1 | 204.79,47.31 205.1,47.62 IC7.10 | v206.38,45.72 205.1,46.99 204.79,47.31 | v208.28,14.61 208.28,19.68 GND1.1 | CONFIGSW.10 78.11,56.52 78.11,57.78 CONFIGSW.11 78.11,59.05 78.11,60.33 CONFIGSW.12 78.11,61.59 78.11,62.87 CONFIGSW.13 78.11,64.14 78.11,65.41 CONFIGSW.14 78.11,66.67 78.11,67.94 CONFIGSW.15 78.11,69.22 78.11,70.48 CONFIGSW.16 78.11,71.75 78.11,73.03 CONFIGSW.17 78.11,74.3 78.11,75.56 CONFIGSW.18 | C40.17 44.45,114.94 44.45,113.67 C40.18 | C40.19 46.99,114.94 46.99,113.67 C40.20 46.99,112.39 47.62,111.76 47.62,62.87 52.07,58.42 IC20.10 | IC14.8 48.26,41.91 45.72,44.45 45.72,46.99 IC14.10 | IC5.10 131.44,59.05 129.54,57.15 v129.54,51.44 129.54,49.53 IC2.15 129.54,46.99 v129.54,44.45
  Top 1.016: v117.47,53.34 117.47,57.78 IC4.10 | v116.84,43.81 116.84,41.91 IC18.8 | v147.32,46.35 147.32,57.78 IC6.10 | CONFIG.11 91.44,75.56 91.44,74.3 CONFIG.9 91.44,73.03 91.44,71.75 CONFIG.7 91.44,70.48 91.44,69.22 CONFIG.5 91.44,67.94 91.44,66.67 CONFIG.3 91.44,65.41 91.44,64.14 CONFIG.1 91.44,62.87 v91.44,58.42 | IC1.10 101.6,57.78 101.6,49.53 IC18.15 101.6,46.99 99.06,44.45 v99.06,43.81 | IC20.1 53.98,81.92 54.61,82.55 54.61,83.19 C7.2 | C6.2 31.75,83.19 31.75,82.55 31.11,81.92 IC21.1 31.75,81.28 33.02,80.01 33.02,56.52 32.7,56.2 | v62.23,43.81 62.23,46.99 IC15.15 | v77.47,43.81 77.47,41.91 IC15.8 | 32.7,56.2 33.02,55.88 33.02,49.53 IC14.15 33.02,46.99 33.02,46.35 28.57,41.91 C19.2 27.94,41.27 27.94,22.86 15.88,10.79 LOCKSW.1 | 32.7,56.2 31.11,57.78 IC21.10 | v310.51,87 v312.42,85.09
  Bottom 1.016: 311.47,46.04 313.69,48.26 IC11.10 | 311.47,46.04 310.51,45.09 v299.08,45.09 283.85,45.09 283.85,47.62 IC13.8 283.21,48.26 v280.67,48.26 | v328.93,45.72 311.79,45.72 311.47,46.04 | V-.1 341,5.71 347.98,5.71 J4.11 348.62,6.35 368.3,6.35 368.62,6.03 | 368.62,6.03 372.75,1.91 J4.13 | 368.62,6.03 368.94,6.35 375.92,6.35 375.92,28.57 J4.14 375.92,29.21 375.29,29.84 v328.93,29.84 313.69,29.84 313.06,30.48 D1.A | 288.61,70.8 288.93,71.12 298.45,71.12 IC17.1 300.99,71.12 303.53,71.12 306.07,68.58 IC17.19 308.61,68.58 311.15,68.58 313.69,71.12 IC11.1 | 288.61,70.8 286.38,68.58 C17.2 285.12,68.58 v280.67,68.58 | v222.25,76.2 236.22,76.2 237.17,75.25 | 237.17,75.25 237.49,74.93 237.49,74.3 C15.2 | 256.22,74.61 255.27,73.66 255.27,71.12 252.73,71.12 IC9.1 | 256.22,74.61 257.18,75.56 266.06,75.56 267.97,73.66 281.31,73.66 283.85,76.2 D2.A 285.12,76.2 287.02,76.2 v288.29,74.93 | 237.17,75.25 237.49,75.56 238.12,76.2 254,76.2 255.27,74.93 255.91,74.93 256.22,74.61 | 288.61,70.8 v288.29,71.12 | D40.18 330.83,113.03 332.11,113.03 D40.20 332.74,112.39 332.74,110.49 339.09,104.14 | 310.51,104.14 310.51,102.23 309.88,101.6 305.44,101.6 R17.1 | 310.51,104.14 297.81,104.14 SLOT2.2 | 339.09,104.14 339.73,104.14 344.17,99.69 J1.2 | 339.09,104.14 310.51,104.14 | GND2.1 367.67,104.14 353.69,104.14 349.25,99.69 J1.3 | v328.93,77.47 v316.23,77.47 | SLOT2.40 248.92,104.78 252.09,107.95 v261.62,107.95 v266.7,107.95 | SLOT2.26 267.33,104.14 268.61,104.14 SLOT2.24 | 279.72,87.31 278.76,86.36 v274.32,86.36 | 279.72,87.31 281.31,88.9 C25.2 | IDE.40 248.92,127.64 250.19,128.91 260.35,128.91 261.62,127.64 IDE.30 262.25,127 263.52,127 IDE.28
  Bottom 1.016: IDE.26 267.33,127 268.61,127 IDE.24 269.88,127 271.14,127 IDE.22 | 115.89,85.41 117.47,83.82 C9.2 | 115.89,85.41 115.57,85.72 105.41,85.72 103.5,83.82 C8.2 | 115.89,85.41 116.2,85.72 v127,85.72 132.08,85.72 132.72,85.09 C16.2 133.99,85.09 135.89,87 144.78,87 147.96,83.82 C18.2 149.22,83.82 152.4,87 v172.09,87 | 214.31,136.21 214,136.53 186.06,136.53 182.88,133.35 GND4.1 | 214.31,136.21 v215.9,134.62 | v172.09,73.66 179.71,66.04 180.97,66.04 186.06,71.12 204.47,71.12 IC7.1 | v246.38,136.53 214.63,136.53 214.31,136.21 | 208.28,13.97 222.88,13.97 C23.2 224.16,13.97 225.43,15.24 244.47,15.24 245.75,16.51 258.44,16.51 EXTRESET.4 | 208.28,13.97 200.66,13.97 199.39,15.24 RS-232.3 | v248.92,45.09 240.66,45.09 237.49,48.26 IC10.10 234.95,48.26 233.04,46.35 224.16,46.35 222.25,48.26 IC8.10 220.34,47.62 220.34,45.72 v206.38,45.72 | GND1.1 205.1,24.13 203.2,26.04 191.13,26.04 X1.G1 | v208.28,14.61 208.28,13.97 | 34.61,6.03 34.29,5.71 17.14,5.71 LOCKSW.1 | 34.61,6.03 35.56,6.99 A40.4 | 101.28,6.67 100.33,5.71 34.92,5.71 34.61,6.03 | 101.28,6.67 101.6,6.99 B40.4 | C40.18 45.09,113.03 46.35,113.03 C40.20 | 46.04,51.12 45.72,50.8 45.72,49.53 IC14.10 | 46.04,51.12 51.12,56.2 | 51.12,56.2 52.7,57.78 IC20.10 | CONFIGSW.10 77.47,55.88 51.44,55.88 51.12,56.2 | v117.47,53.34 119.38,51.44 v129.54,51.44 | 143.83,42.86 142.24,44.45 v129.54,44.45 127.64,44.45 125.09,41.91 C22.2 123.83,41.91 121.92,43.81 v116.84,43.81 v99.06,43.81 97.16,41.91 C21.2 95.89,41.91 93.98,43.81 v77.47,43.81 v62.23,43.81 55.24,43.81 54.93,43.5 | 143.83,42.86 144.78,41.91 IC2.8 145.41,41.27 171.45,41.27 v172.09,41.91
  Bottom 1.016: v147.32,46.35 144.15,43.18 143.83,42.86 | 54.93,43.5 54.61,43.81 30.48,43.81 28.57,41.91 C19.2 | 54.93,43.5 56.52,41.91 C20.2 | C7.2 54.61,84.45 54.61,86.36 34.92,86.36 32.38,83.82 C6.2 | v91.44,58.42 100.33,58.42 IC1.10 | 46.04,51.12 45.72,51.44 40.64,56.52 33.66,56.52 31.75,58.42 IC21.10 | X1.G2 188.59,4.45 187.96,5.08 102.87,5.08 101.6,6.35 101.28,6.67 | v312.42,85.09 v328.93,85.09 | v310.51,87 280.04,87 279.72,87.31
I2C-SCL  (via drill 0.61)
  Top 0.381: v325.12,69.22 325.12,41.27 322.58,38.73 XESS.23 | v323.85,93.34 v323.85,74.3 | v298.45,91.44 v298.45,100.33 | v262.89,90.17 262.89,99.69 264.16,100.97 SLOT2.27
  Bottom 0.381: v325.12,69.22 327.66,71.75 327.66,74.3 v323.85,74.3 | v323.85,93.34 316.87,100.33 v298.45,100.33 | v298.45,91.44 297.81,90.81 265.43,90.81 264.8,90.17 v262.89,90.17
I2C-SDA  (via drill 0.61)
  Top 0.381: v261.62,129.54 257.81,129.54 257.81,118.75 256.54,117.47 256.54,116.2 260.35,112.39 260.35,103.5 261.62,102.23 SLOT2.29
  Bottom 0.381: v261.62,129.54 301.62,129.54 305.44,125.73 339.09,125.73 339.09,123.83 340.36,122.56 358.14,122.56 369.57,111.12 375.92,111.12 375.92,66.04 349.88,40.01 322.58,40.01 320.68,38.1 XESS.24
IDE-CS0#  (via drill 0.61)
  Top 0.381: v252.73,105.41 252.73,122.56 251.46,123.83 IDE.37 | v287.02,97.16 289.56,94.61 289.56,83.19 XESS.7
  Bottom 0.381: v252.73,105.41 252.73,102.87 262.25,102.87 262.89,102.23 262.89,97.16 v287.02,97.16
IDE-CS1#  (via drill 0.61)
  Top 0.381: v292.1,88.27 292.1,83.19 XESS.8 | v311.15,90.17 312.42,91.44 v312.42,101.6 | v323.85,102.87 v323.85,135.89 | v258.44,135.25 251.46,128.27 251.46,127.64 IDE.38
  Bottom 0.381: v292.1,88.27 293.37,89.53 303.53,89.53 304.17,90.17 v311.15,90.17 | v312.42,101.6 313.69,102.87 v323.85,102.87 | v323.85,135.89 322.58,137.16 261.62,137.16 259.71,135.25 v258.44,135.25
IDE-DMACK#  (via drill 0.61)
  Top 0.381: v273.05,26.67 273.05,36.2 271.78,37.47 XESS.43 | v339.73,28.57 v342.26,31.11 | v347.35,35.56 349.25,37.47 349.25,59.05 349.88,59.69 v349.88,75.56 | v338.45,80.01 337.19,81.28 337.19,111.76 336.55,112.39 v336.55,118.11 | v262.89,128.27 262.89,126.36 261.62,125.09 IDE.29
  Bottom 0.381: v273.05,26.67 285.75,26.67 287.65,28.57 v339.73,28.57 | v342.26,31.11 346.71,35.56 v347.35,35.56 | v349.88,75.56 345.44,80.01 v338.45,80.01 | v336.55,118.11 333.38,118.11 328.3,123.19 306.7,123.19 301.62,128.27 v262.89,128.27
IDE-DMARQ  (via drill 0.61)
  Top 0.381: R12.1 314.96,99.69 314.96,100.97 R17.2 | v250.19,20.32 250.19,24.13 252.09,24.13 255.27,27.3 255.27,28.57 256.54,29.84 256.54,37.47 XESS.49 | v216.53,22.23 211.46,27.3 193.68,27.3 193.68,26.67 192.41,25.4 173.35,25.4 v173.35,126.36 | v335.92,128.27 339.09,125.09 v339.09,102.87
  Bottom 0.381: v250.19,20.32 246.38,20.32 244.47,18.41 233.04,18.41 232.41,19.05 232.41,22.23 v216.53,22.23 | v173.35,126.36 173.99,127 246.38,127 250.19,130.81 309.25,130.81 311.79,128.27 v335.92,128.27 | v339.09,102.87 337.82,101.6 315.6,101.6 R17.2
IDE-IORDY  (via drill 0.61)
  Top 0.381: R15.1 314.96,92.08 316.23,93.34 316.23,94.61 317.5,95.89 R19.1 | v269.24,15.24 269.24,37.47 XESS.44 | v330.2,16.51 338.45,24.77 338.45,36.2 342.26,40.01 342.26,65.41 341,66.67 v341,82.55
  Bottom 0.381: v269.24,15.24 294,15.24 295.27,16.51 v330.2,16.51 | v341,82.55 335.92,87.63 319.4,87.63 315.6,91.44 R15.1
IDE-IRQ
  Top 0.381: R16.1 314.96,89.53 317.5,92.08 317.5,93.34 R18.2
  Bottom 0.381: XESS.3 280.04,82.55 283.21,85.72 311.15,85.72 314.32,88.9 R16.1
IF0
  Top 0.381: R134.2 52.07,104.78 52.07,112.39 C40.24
IF1
  Top 0.381: R136.2 54.61,123.83 54.61,116.2 C40.25
IF2
  Top 0.381: R138.2 64.77,104.78 64.77,112.39 C40.34
ION
  Top 0.381: R62.2 350.52,123.83 349.25,122.56 349.25,114.94 350.52,113.67 D40.34
IOT
  Top 0.381: R55.2 332.74,123.83 337.82,118.75 337.82,116.2 D40.23
ISZ
  Top 0.381: R52.2 314.96,123.83 314.96,117.47 313.69,116.2 313.69,114.94 314.96,113.67 D40.6
JMP
  Top 0.381: R59.2 322.58,123.83 322.58,117.47 321.31,116.2 321.31,114.94 322.58,113.67 D40.12
JMS
  Top 0.381: R97.2 320.04,123.83 318.77,122.56 318.77,114.94 320.04,113.67 D40.10
L0#  (1 unrouted)
  Bottom 0.381: IC21.11 39.37,58.42 40.64,59.69 58.42,59.69 59.69,58.42 IC20.11
L1#  (1 unrouted)
  Bottom 0.381: IC1.11 110.49,58.42 114.3,58.42 115.57,59.69 121.92,59.69 123.19,58.42 IC4.11
L2#  (via drill 0.61)
  Top 0.381: v295.27,58.42 295.91,57.78 295.91,54.61 295.27,53.98 v295.27,49.53 | v254.63,40.01 v254.63,49.53 | v160.02,45.72 155.57,50.16 155.57,57.78 IC6.11
  Bottom 0.381: IC6.11 153.67,58.42 149.86,58.42 148.59,59.69 140.97,59.69 IC5.11 | v295.27,58.42 293.37,58.42 IC13.13 | v295.27,49.53 269.88,49.53 268.61,50.8 261.62,50.8 260.35,49.53 v254.63,49.53 | v254.63,40.01 194.31,40.01 187.32,33.02 182.88,33.02 170.18,45.72 v160.02,45.72
L3#  (via drill 0.61)
  Top 0.381: v278.13,34.29 v278.13,54.61 | v227.33,33.02 227.33,48.26 IC8.11
  Bottom 0.381: IC7.11 214.63,48.26 218.44,48.26 219.71,49.53 226.06,49.53 227.33,48.26 IC8.11 | v278.13,54.61 290.83,54.61 291.46,55.24 IC13.12 | v278.13,34.29 264.16,34.29 262.89,33.02 v227.33,33.02
L4#  (via drill 0.61)
  Top 0.381: v288.93,41.27 288.93,50.16 291.46,52.7 IC13.11 | v259.71,40.01 259.71,47.62 IC9.11
  Bottom 0.381: IC10.11 245.11,48.26 246.38,49.53 252.73,49.53 254,48.26 257.81,48.26 IC9.11 | v288.93,41.27 282.57,41.27 281.31,40.01 v259.71,40.01
L5#
  Bottom 0.381: 325.12,49.53 323.85,48.26 IC11.11 | 325.12,49.53 335.28,49.53 336.55,48.26 IC12.11 | 325.12,49.53 298.45,49.53 297.18,50.8 293.37,50.8 IC13.10
LA
  Top 0.381: R43.1 119.38,19.68 119.38,12.06 118.11,10.79 118.11,9.53 119.38,8.26 B40.18 119.38,6.99 119.38,6.35 122.56,6.35 123.19,6.99 123.19,10.79 125.09,12.7 125.09,27.94 133.35,36.2 133.35,45.72 132.08,46.99 IC2.14
LCLK
  Top 0.381: IC17.14 306.7,56.52 305.44,57.78 305.44,59.05 306.7,60.33 IC17.16
LINK
  Top 0.381: R139.2 57.15,104.78 57.15,112.39 C40.28
MA0
  Top 0.381: R99.2 109.22,123.83 109.22,116.2 E40.3
MA1
  Top 0.381: R104.2 114.3,104.78 114.3,112.39 E40.8
MA2
  Top 0.381: R109.2 121.92,123.83 121.92,116.2 E40.13
MA3
  Top 0.381: R114.2 132.08,104.78 132.08,112.39 E40.22
MA4
  Top 0.381: R119.2 139.7,123.83 139.7,116.2 E40.27
MA5
  Top 0.381: R124.2 144.78,104.78 144.78,112.39 E40.32
MA6
  Top 0.381: R68.2 198.12,123.83 198.12,116.2 F40.3
MA7
  Top 0.381: R73.2 203.2,104.78 203.2,112.39 F40.8
MA8
  Top 0.381: R78.2 210.82,123.83 210.82,116.2 F40.13
MA9
  Top 0.381: R83.2 220.98,104.78 220.98,112.39 F40.22
MA10
  Top 0.381: R88.2 228.6,123.83 228.6,116.2 F40.27
MA11
  Top 0.381: R93.2 233.68,104.78 233.68,112.39 F40.32
MASTER-RESET#  (via drill 0.61)
  Top 0.381: v296.55,72.39 296.55,69.22 299.08,66.67 IC17.3 | v303.53,72.39 303.53,84.45 297.18,90.81 297.18,100.97 SLOT2.1 | v305.44,120.65 307.34,118.75 307.34,109.86 309.25,107.95 v309.25,102.87
  Bottom 0.381: v296.55,72.39 v303.53,72.39 | v305.44,120.65 301.62,120.65 297.81,124.46 IDE.1 | v309.25,102.87 301.62,102.87 300.36,101.6 297.81,101.6 SLOT2.1
MB0
  Top 0.381: R100.2 111.76,123.83 111.76,116.2 E40.5
MB1
  Top 0.381: R105.2 111.76,104.78 111.76,112.39 E40.6
MB2
  Top 0.381: R110.2 124.46,123.83 124.46,116.2 E40.15
MB3
  Top 0.381: R115.2 124.46,104.78 124.46,112.39 E40.16
MB4
  Top 0.381: R120.2 142.24,123.83 142.24,116.2 E40.29
MB5
  Top 0.381: R125.2 142.24,104.78 142.24,112.39 E40.30
MB6
  Top 0.381: R69.2 200.66,123.83 200.66,116.2 F40.5
MB7
  Top 0.381: R74.2 200.66,104.78 200.66,112.39 F40.6
MB8
  Top 0.381: R79.2 213.36,123.83 213.36,116.2 F40.15
MB9
  Top 0.381: R84.2 213.36,104.78 213.36,112.39 F40.16
MB10
  Top 0.381: R89.2 231.14,123.83 231.14,116.2 F40.29
MB11
  Top 0.381: R94.2 231.14,104.78 231.14,112.39 F40.30
MQ0
  Top 0.381: R102.2 116.84,123.83 116.84,116.2 E40.9
MQ1
  Top 0.381: R107.2 106.68,104.78 106.68,112.39 E40.2
MQ2
  Top 0.381: R112.2 134.62,123.83 134.62,116.2 E40.23
MQ3
  Top 0.381: R117.2 119.38,104.78 119.38,112.39 E40.12
MQ4
  Top 0.381: R122.2 147.32,123.83 147.32,116.2 E40.33
MQ5
  Top 0.381: R127.2 137.16,104.78 137.16,112.39 E40.26
MQ6
  Top 0.381: R71.2 205.74,123.83 205.74,116.2 F40.9
MQ7
  Top 0.381: R76.2 195.58,104.78 195.58,112.39 F40.2
MQ8
  Top 0.381: R81.2 223.52,123.83 223.52,116.2 F40.23
MQ9
  Top 0.381: R86.2 208.28,104.78 208.28,112.39 F40.12
MQ10
  Top 0.381: R91.2 236.22,123.83 236.22,116.2 F40.33
MQ11
  Top 0.381: R96.2 226.06,104.78 226.06,112.39 F40.26
N$1
  Bottom 0.381: IC14.9 48.9,48.9 50.16,50.16 73.03,50.16 74.3,48.9 IC15.10
N$2
  Bottom 0.381: IC15.9 78.11,48.9 79.38,50.16 140.34,50.16 141.6,48.9 IC2.10
N$3
  Bottom 0.381: IC18.10 114.94,47.62 116.84,45.72 142.24,45.72 144.15,47.62 IC2.9
N$5
  Top 0.381: IC3.10 241.3,21.59 241.3,27.3 R3.2
N$6
  Top 0.381: IC3.11 238.76,21.59 238.76,24.77 R1.2
N$7  (via drill 0.61)
  Top 0.381: v289.56,21.59 289.56,29.84 R2.2
  Bottom 0.381: v289.56,21.59 245.11,21.59 244.47,20.95 IC3.9
N$8
  Top 0.381: C1.2 228.6,8.26 228.6,11.43 IC3.2
N$9
  Top 0.381: C2.2 231.14,5.71 231.14,11.43 IC3.3
N$11
  Top 0.381: C2.1 226.06,5.71 226.06,11.43 IC3.1
N$12
  Top 0.381: C4.1 241.3,5.71 240.03,6.99 240.03,10.16 238.76,11.43 IC3.6
N$18
  Top 0.381: C3.1 233.68,8.26 233.68,11.43 IC3.4
N$20
  Top 0.381: C3.2 238.76,8.26 236.22,10.79 236.22,11.43 IC3.5
N$24  (via drill 0.61)
  Top 0.381: v313.69,111.76 313.69,81.92 313.06,81.28 313.06,70.48 314.32,69.22 IC11.2 | v316.23,118.11 316.23,132.72 317.5,133.99 R51.1
  Bottom 0.381: v313.69,111.76 313.69,118.11 v316.23,118.11
N$25  (via drill 0.61)
  Top 0.381: v342.26,67.31 v342.26,87.63 | v322.58,90.17 v322.58,111.12 | v313.69,121.92 313.69,132.72 314.96,133.99 R52.1
  Bottom 0.381: v342.26,67.31 335.28,67.31 332.74,64.77 328.93,64.77 326.39,62.23 321.31,62.23 320.04,60.96 316.23,60.96 IC11.5 | v342.26,87.63 339.73,90.17 v322.58,90.17 | v322.58,111.12 321.31,112.39 321.31,118.11 319.4,118.11 315.6,121.92 v313.69,121.92
N$26  (via drill 0.61)
  Top 0.381: v316.23,36.83 316.23,38.73 313.06,41.91 313.06,56.52 314.32,57.78 IC11.6 | v363.86,36.83 366.39,39.37 v366.39,94.61 | v355.6,102.87 354.33,104.14 v354.33,124.46 | v312.42,129.54 312.42,133.99 R53.1
  Bottom 0.381: v316.23,36.83 v363.86,36.83 | v366.39,94.61 358.14,102.87 v355.6,102.87 | v354.33,124.46 349.25,129.54 v312.42,129.54
N$28  (via drill 0.61)
  Top 0.381: v294.64,55.88 294,56.52 294,72.39 294.64,73.03 R11.1
  Bottom 0.381: v294.64,55.88 298.45,55.88 IC17.7
N$30
  Top 0.381: R22.2 259.08,111.12 257.81,109.86 257.81,103.5 259.08,102.23 SLOT2.31
N$31  (via drill 0.61)
  Top 0.381: C5.1 264.16,17.14 264.16,16.51 EXTRESET.2 263.52,13.97 263.52,3.81 EXTRESET.1 264.8,3.81 271.14,3.81 273.05,5.71 273.05,15.88 271.78,17.14 271.78,27.3 R23.2 | v300.99,31.75 300.99,38.73 303.53,41.27 303.53,59.69 306.7,62.87 IC17.17
  Bottom 0.381: R20.2 266.06,17.78 264.8,17.78 C5.1 | v300.99,31.75 287.65,31.75 285.12,29.21 278.13,29.21 276.86,27.94 272.42,27.94 R23.2
N$32  (via drill 0.61)
  Top 0.381: v365.12,69.22 365.12,114.94 v366.39,116.2
  Bottom 0.381: v365.12,69.22 347.98,52.07 321.31,52.07 320.04,50.8 316.23,50.8 IC11.9 | v366.39,116.2 351.79,130.81 314.32,130.81 310.51,134.62 R54.1
N$33  (via drill 0.61)
  Top 0.381: v320.68,46.99 320.68,48.9 321.94,50.16 IC11.12 | v344.81,46.99 v344.81,75.56 | v337.82,76.2 335.92,78.11 v335.92,105.41 | v328.93,119.38 328.93,130.18 332.74,133.99 R55.1
  Bottom 0.381: v320.68,46.99 v344.81,46.99 | v344.81,75.56 344.17,76.2 v337.82,76.2 | v335.92,105.41 328.93,112.39 v328.93,119.38
N$34  (via drill 0.61)
  Top 0.381: v360.68,66.67 v360.68,126.36
  Bottom 0.381: v360.68,66.67 351.15,57.15 325.12,57.15 323.85,58.42 IC11.15 | v360.68,126.36 351.15,135.89 332.11,135.89 330.83,134.62 R56.1
N$35  (via drill 0.61)
  Top 0.381: v352.43,62.23 352.43,92.71 353.06,93.34 v353.06,123.83 | v327.66,127 327.66,133.99 R57.1
  Bottom 0.381: v352.43,62.23 334.01,62.23 331.47,59.69 325.12,59.69 323.85,60.96 IC11.16 | v353.06,123.83 349.88,127 v327.66,127
N$36  (via drill 0.61)
  Top 0.381: v326.39,72.39 326.39,109.86 328.93,112.39 328.93,117.47 326.39,120.02 326.39,132.72 325.12,133.99 R58.1
  Bottom 0.381: v326.39,72.39 323.21,69.22 IC11.19
N$37  (via drill 0.61)
  Top 0.381: v327.66,92.08 327.66,71.12 329.56,69.22 IC12.2 | v325.12,94.61 v325.12,111.12 | v321.31,119.38 321.31,132.72 322.58,133.99 R59.1
  Bottom 0.381: v327.66,92.08 v325.12,94.61 | v325.12,111.12 323.85,112.39 323.85,119.38 v321.31,119.38
N$38  (via drill 0.61)
  Top 0.381: v346.07,64.77 346.07,90.17 342.9,93.34 342.9,111.12 341.63,112.39 341.63,130.18 345.44,133.99 R60.1
  Bottom 0.381: v346.07,64.77 334.01,64.77 330.83,61.59 IC12.5
N$39  (via drill 0.61)
  Top 0.381: v363.86,71.75 363.86,115.57 365.12,116.84 365.12,125.73 354.96,135.89 347.98,135.89 347.98,135.25 R61.1
  Bottom 0.381: v363.86,71.75 351.79,59.69 332.74,59.69 331.47,58.42 IC12.6
N$40  (via drill 0.61)
  Top 0.381: v350.52,49.53 354.96,45.09 354.96,27.3 355.6,26.67 362.58,26.67 v362.58,105.41 | v358.14,109.86 358.14,126.36 350.52,133.99 R62.1
  Bottom 0.381: v350.52,49.53 336.55,49.53 335.28,50.8 331.47,50.8 IC12.9 | v362.58,105.41 v358.14,109.86
N$41  (via drill 0.61)
  Top 0.381: v358.77,50.8 359.41,51.44 v359.41,125.09
  Bottom 0.381: v358.77,50.8 339.09,50.8 IC12.12 | v359.41,125.09 351.15,133.35 344.81,133.35 343.54,134.62 R63.1
N$42  (via drill 0.61)
  Top 0.381: v347.35,58.42 348.62,59.69 v348.62,92.08 | v356.24,101.6 356.87,102.23 356.87,125.73 349.25,133.35 346.71,133.35 346.71,135.25 346.07,135.89 340.36,135.89 340.36,135.25 R64.1
  Bottom 0.381: v347.35,58.42 339.09,58.42 IC12.15 | v348.62,92.08 351.79,92.08 353.06,93.34 353.06,101.6 v356.24,101.6
N$43  (via drill 0.61)
  Top 0.381: v339.73,91.44 339.73,62.87 338.45,61.59 IC12.16 | v331.47,99.69 331.47,127.64 337.82,133.99 R65.1
  Bottom 0.381: v339.73,91.44 v331.47,99.69
N$44  (via drill 0.61)
  Top 0.381: v367.67,73.03 376.56,81.92 376.56,127.64 367.03,137.16 335.28,137.16 335.28,135.25 R66.1
  Bottom 0.381: v367.67,73.03 343.54,73.03 339.09,68.58 IC12.19
N$45  (via drill 0.61)
  Top 0.381: v194.94,68.58 194.31,69.22 194.31,132.72 195.58,133.99 R67.1
  Bottom 0.381: v194.94,68.58 204.47,68.58 IC7.2
N$46  (via drill 0.61)
  Top 0.381: v192.41,131.44 184.15,123.19 v184.15,86.36 | v177.8,83.19 v177.8,45.09 | v206.38,43.18 208.28,41.27 211.46,41.27 v211.46,59.69
  Bottom 0.381: v192.41,131.44 194.31,131.44 197.49,134.62 R68.1 | v184.15,86.36 180.97,83.19 v177.8,83.19 | v177.8,45.09 179.71,43.18 v206.38,43.18 | v211.46,59.69 208.28,59.69 207.01,60.96 IC7.5
N$47  (via drill 0.61)
  Top 0.381: v193.04,130.18 186.06,123.19 v186.06,52.07 | v201.29,50.8 203.84,53.34 203.84,56.52 205.1,57.78 IC7.6
  Bottom 0.381: v193.04,130.18 195.58,130.18 200.03,134.62 R69.1 | v186.06,52.07 187.32,50.8 v201.29,50.8
N$48  (via drill 0.61)
  Top 0.381: v200.03,45.72 200.03,46.35 204.47,50.8 IC7.9 | v179.07,45.72 v179.07,98.42 | v201.93,106.05 201.93,132.72 203.2,133.99 R70.1
  Bottom 0.381: v200.03,45.72 v179.07,45.72 | v179.07,98.42 186.69,106.05 v201.93,106.05
N$49  (via drill 0.61)
  Top 0.381: v189.87,49.53 v189.87,93.98 | v195.58,95.89 202.56,102.87 204.47,102.87 204.47,132.72 205.74,133.99 R71.1
  Bottom 0.381: v189.87,49.53 207.01,49.53 208.28,50.8 212.09,50.8 IC7.12 | v189.87,93.98 191.77,95.89 v195.58,95.89
N$50  (via drill 0.61)
  Top 0.381: v210.19,58.42 v210.19,66.67 | v201.93,69.85 v201.93,91.44 | v204.47,91.44 205.74,92.71 205.74,93.34 R72.1
  Bottom 0.381: v210.19,58.42 212.09,58.42 IC7.15 | v210.19,66.67 207.01,69.85 v201.93,69.85 | v201.93,91.44 v204.47,91.44
N$51  (via drill 0.61)
  Top 0.381: v203.84,62.23 203.2,62.87 203.2,93.34 R73.1
  Bottom 0.381: v203.84,62.23 207.01,62.23 208.28,60.96 212.09,60.96 IC7.16
N$52  (via drill 0.61)
  Top 0.381: v307.98,88.9 310.51,91.44 v310.51,110.49 | v260.99,116.84 259.08,118.75 259.08,123.83 IDE.31
  Bottom 0.381: v307.98,88.9 305.44,88.9 R16.2 | v310.51,110.49 304.17,116.84 v260.99,116.84
N$53  (via drill 0.61)
  Top 0.381: v307.98,107.31 v307.98,92.71 | v265.43,114.3 264.16,115.57 264.16,123.83 IDE.27
  Bottom 0.381: v307.98,92.71 306.7,92.71 305.44,91.44 R15.2 | v307.98,107.31 300.99,114.3 v265.43,114.3
N$54  (via drill 0.61)
  Top 0.381: v303.53,108.58 303.53,95.89 304.8,94.61 R14.2 | v266.7,111.76 266.7,123.83 IDE.25
  Bottom 0.381: v303.53,108.58 300.36,111.76 v266.7,111.76
N$55  (via drill 0.61)
  Top 0.381: v302.26,107.95 v302.26,96.52 | v269.88,109.22 269.24,109.86 269.24,123.83 IDE.23
  Bottom 0.381: v302.26,96.52 304.17,96.52 R13.2 | v302.26,107.95 301.62,108.58 295.27,108.58 294.64,109.22 v269.88,109.22
N$56  (via drill 0.61)
  Top 0.381: v300.99,107.31 v300.99,99.06 | v271.14,107.95 271.14,121.92 271.78,122.56 271.78,123.83 IDE.21
  Bottom 0.381: v300.99,99.06 304.17,99.06 R12.2 | v300.99,107.31 295.27,107.31 294.64,107.95 v271.14,107.95
N$57
  Top 0.381: IC7.19 212.09,68.58 209.55,68.58 209.55,94.61 208.91,95.25 200.66,95.25 200.66,94.61 R74.1
N$58  (via drill 0.61)
  Top 0.381: v276.86,67.31 v276.86,72.39 | v292.1,72.39 292.74,73.03 292.74,81.28 293.37,81.92 v293.37,99.06 | v295.91,100.33 295.91,102.23 296.55,102.87 298.45,102.87 298.45,125.09 309.25,135.89 320.04,135.89 320.04,135.25 R97.1
  Bottom 0.381: v276.86,67.31 246.38,67.31 245.11,68.58 IC10.19 | v276.86,72.39 v292.1,72.39 | v293.37,99.06 294.64,100.33 v295.91,100.33
N$59  (via drill 0.61)
  Top 0.381: v226.06,85.09 226.06,93.34 R96.1 | v243.84,86.36 245.11,85.09 245.11,72.39 246.38,71.12 246.38,65.41 247.65,64.14 v247.65,58.42
  Bottom 0.381: v226.06,85.09 233.04,85.09 234.31,86.36 v243.84,86.36 | v247.65,58.42 245.11,58.42 IC10.15
N$60  (via drill 0.61)
  Top 0.381: v248.92,50.8 249.56,51.44 249.56,81.28 250.19,81.92 v250.19,95.25
  Bottom 0.381: v248.92,50.8 245.11,50.8 IC10.12 | v250.19,95.25 249.56,95.89 231.14,95.89 229.24,93.98 R95.1
N$61  (via drill 0.61)
  Top 0.381: v227.33,105.41 227.33,98.42 231.14,94.61 R94.1 | v170.81,107.31 v170.81,65.41 | v226.06,65.41 226.69,64.77 226.69,62.87 227.33,62.23 231.78,62.23 v231.78,50.8
  Bottom 0.381: v227.33,105.41 225.43,107.31 v170.81,107.31 | v170.81,65.41 171.45,64.77 225.43,64.77 v226.06,65.41 | v231.78,50.8 234.95,50.8 IC10.9
N$62  (via drill 0.61)
  Top 0.381: v232.41,36.83 232.41,38.73 233.04,39.37 233.04,55.24 235.59,57.78 IC10.6 | v194.94,36.2 193.68,37.47 193.68,65.41 196.85,68.58 196.85,95.25 v203.2,101.6 | v229.24,102.23 233.68,97.79 233.68,94.61 R93.1
  Bottom 0.381: v232.41,36.83 214,36.83 212.72,35.56 208.28,35.56 207.65,36.2 v194.94,36.2 | v203.2,101.6 203.84,102.23 v229.24,102.23
N$63
  Top 0.381: IC10.5 235.59,61.59 234.31,62.87 234.31,81.28 234.95,81.92 234.95,83.19 236.22,84.45 236.22,93.34 R92.1
N$64
  Top 0.381: IC10.2 236.85,69.22 238.76,71.12 238.76,76.83 237.49,78.11 237.49,132.72 236.22,133.99 R91.1
N$65  (via drill 0.61)
  Top 0.381: v211.46,69.85 210.82,70.48 v210.82,89.53 | v198.12,90.17 198.12,93.34 R75.1
  Bottom 0.381: v211.46,69.85 214.63,69.85 215.9,68.58 219.71,68.58 IC8.2 | v210.82,89.53 210.19,90.17 v198.12,90.17
N$66  (via drill 0.61)
  Top 0.381: v195.58,81.28 195.58,93.34 R76.1 | v220.34,80.64 223.52,77.47 223.52,63.5 221.62,61.59 IC8.5
  Bottom 0.381: v195.58,81.28 197.49,79.38 218.44,79.38 219.71,80.64 v220.34,80.64
N$67  (via drill 0.61)
  Top 0.381: v211.46,62.23 v211.46,67.31 | v240.03,69.85 v240.03,72.39 | v250.82,73.66 252.73,75.56 v252.73,83.82 | v246.38,86.36 245.11,87.63 v245.11,132.08
  Bottom 0.381: v211.46,62.23 214.63,62.23 218.44,58.42 219.71,58.42 IC8.6 | v211.46,67.31 224.79,67.31 227.33,69.85 v240.03,69.85 | v240.03,72.39 249.56,72.39 v250.82,73.66 | v252.73,83.82 250.19,86.36 v246.38,86.36 | v245.11,132.08 211.46,132.08 208.91,134.62 R77.1
N$68  (via drill 0.61)
  Top 0.381: v205.74,130.18 210.19,134.62 R78.1 | v200.66,130.18 196.85,126.36 v196.85,102.87 | v191.77,99.69 191.13,99.06 v191.13,34.92 | v208.91,37.47 215.26,43.81 215.26,50.16 v215.9,50.8
  Bottom 0.381: v200.66,130.18 v205.74,130.18 | v196.85,102.87 193.68,99.69 v191.77,99.69 | v191.13,34.92 193.68,37.47 v208.91,37.47 | v215.9,50.8 219.71,50.8 IC8.9
N$69
  Top 0.381: R79.1 212.72,134.62 210.82,136.53 161.93,136.53 161.93,104.14 167,99.06 167,30.48 174.62,22.86 203.84,22.86 203.84,17.14 208.91,12.06 217.81,12.06 217.81,8.89 218.44,8.26 220.34,8.26 220.34,24.77 224.79,29.21 224.79,46.99 227.97,50.16 IC8.12
N$70  (via drill 0.61)